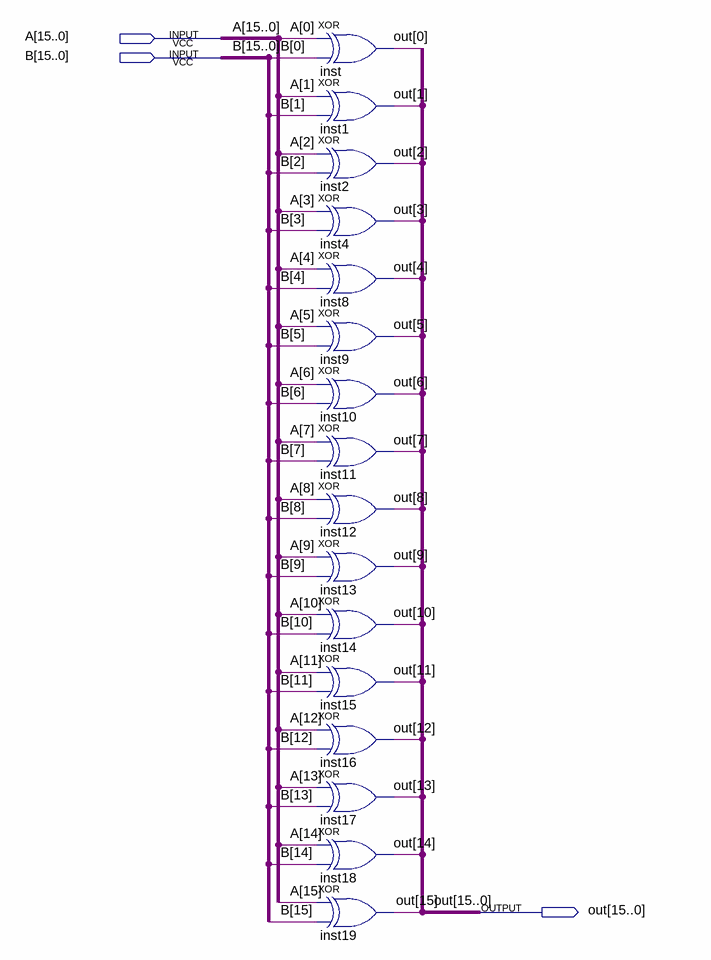
[diagram p0: schematic sheet]
// Quartus schematic 16bit_xor.bdf as structural Verilog: 16 symbols, 3 pins
module \16bit_xor  (
  input  [15:0] A,
  input  [15:0] B,
  output [15:0] out
);

  xor inst (out[0], A[0], B[0]);
  xor inst1 (out[1], A[1], B[1]);
  xor inst2 (out[2], A[2], B[2]);
  xor inst4 (out[3], A[3], B[3]);
  xor inst8 (out[4], A[4], B[4]);
  xor inst9 (out[5], A[5], B[5]);
  xor inst10 (out[6], A[6], B[6]);
  xor inst11 (out[7], A[7], B[7]);
  xor inst12 (out[8], A[8], B[8]);
  xor inst13 (out[9], A[9], B[9]);
  xor inst14 (out[10], A[10], B[10]);
  xor inst15 (out[11], A[11], B[11]);
  xor inst16 (out[12], A[12], B[12]);
  xor inst17 (out[13], A[13], B[13]);
  xor inst18 (out[14], A[14], B[14]);
  xor inst19 (out[15], A[15], B[15]);
endmodule
